# EAGLE schematic 123_relay (EAGLE 9.6.0)
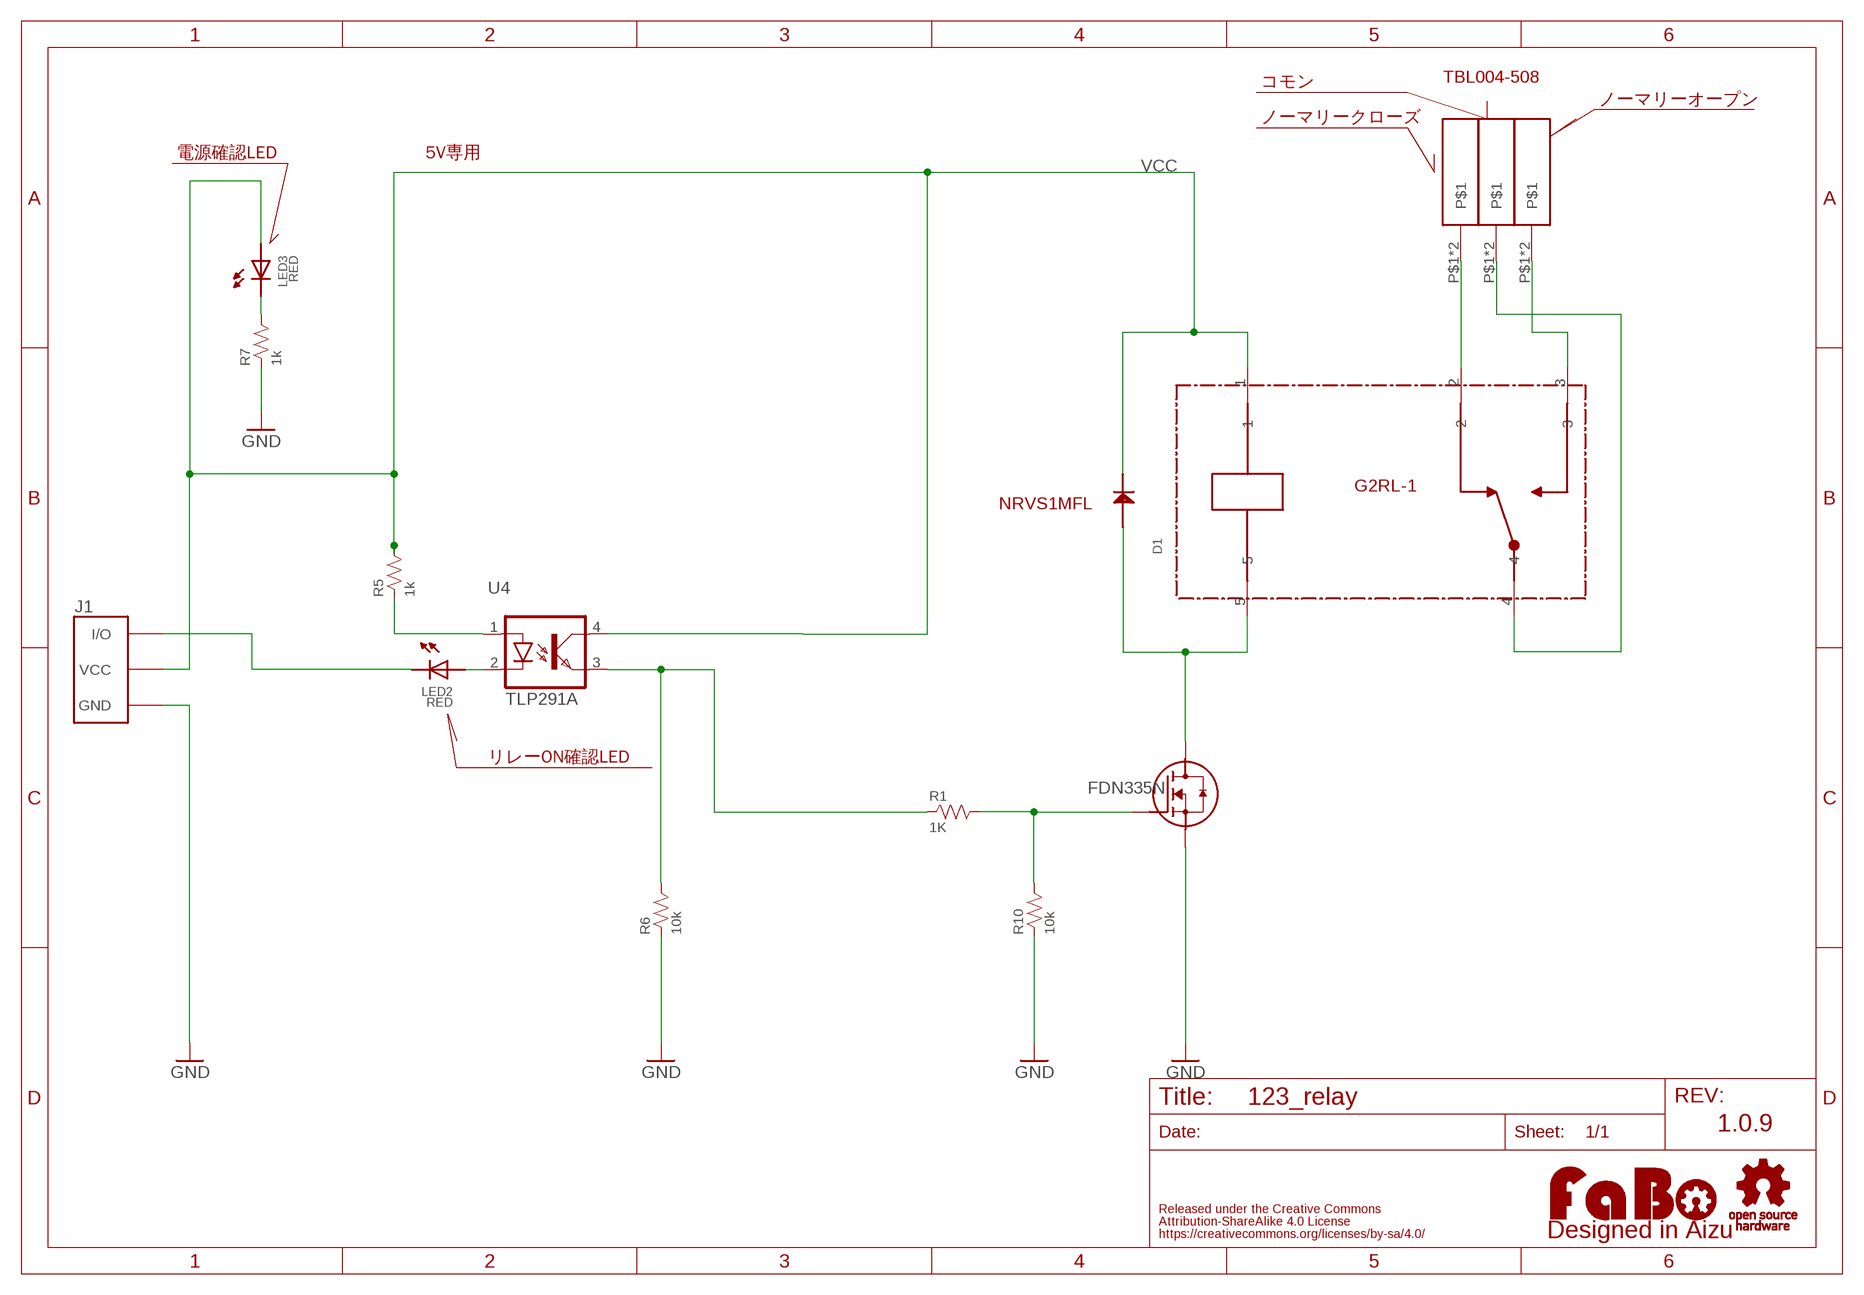
[diagram p0: schematic, sheet 1]

## Parts
D1  NRVS1MFL  [SD-123F]
FET  FDN335N  [FDN335]
J1  FABO_BRICK_3PIN-S03B-PASK-2_LONG  [FABO_BRICK_3PIN_S03B-PASK-2_LONG]
LED2  RED  LED-0603  [0603]
LED3  RED  LED-0603  [0603]
LOGO1  LOGO_FABO-M  [LOGO_FABO_M]
R1  1K  RESISTOR-0603-NARROW  [0603-NARROW]
R5  1k  RESISTOR-0603-NARROW  [0603-NARROW]
R6  10k  RESISTOR-0603-NARROW  [0603-NARROW]
R7  1k  RESISTOR-0603-NARROW  [0603-NARROW]
R10  10k  RESISTOR-0603-NARROW  [0603-NARROW]
U4  TLP291A  [11-3C1]
U$2  G2RL-1  [G2RL-1]
U$3  TBL004-508  [TBL004-508]
U$4  TBL004-508  [TBL004-508]
U$5  TBL004-508  [TBL004-508]
U$10  LOGO_OSHW-M_BOTTOM  [LOGO_OSHW_M_BOTTOM]

## Nets
GND: FET.2:S(S) J1.GND R6.1 R7.1 R10.1
N$1: J1.I/O LED2.CATHODE
N$2: LED2.ANODE U4.2(C)
N$4: U$2.4 U$4.P$1 U$4.P$2
N$5: R5.1 U4.1(A)
N$7: U$2.2 U$3.P$1 U$3.P$2
N$9: D1.1(ANODE) FET.3:D(D) U$2.5
N$14: R1.1 R6.2 U4.3(EMI)
N$15: U$2.3 U$5.P$1 U$5.P$2
N$17: LED3.CATHODE R7.2
RELAY02: FET.1:G(G) R1.2 R10.2
VCC: D1.2(CATHODE) J1.VCC LED3.ANODE R5.2 U4.4(COL) U$2.1

## Notes on the sheet
- コモン | TBL004-508
- ノーマリーオープン
- ノーマリークローズ
- 電源確認LED | 5V専用
- G2RL-1
- NRVS1MFL
- リレーON確認LED
- 1.0.9

## Library data of the parts
D1 = FaBo-Diode:NRVS1MFL
FET = FaBo-Mosfet:FDN335N
J1 = FaBo-Template:FABO_BRICK_3PIN: FaBo Brick 3pin
LED2 = FaBo-LED:LED; SPICEPREFIX: L
LED3 = FaBo-LED:LED
LOGO1 = component:LOGO_FABO
R1 R6 R7 R10 = FaBo-Resistors:RESISTOR: RESISTOR
R5 = FaBo-Resistors:RESISTOR: RESISTOR; SPICEPREFIX: R
U4 = FaBo_Photocoupler:TLP291A
U$2 = FaBo-Relay:G2RL-1
U$3-U$5 = FaBo-Terminal:TBL004-508
U$10 = component:LOGO_OSHW